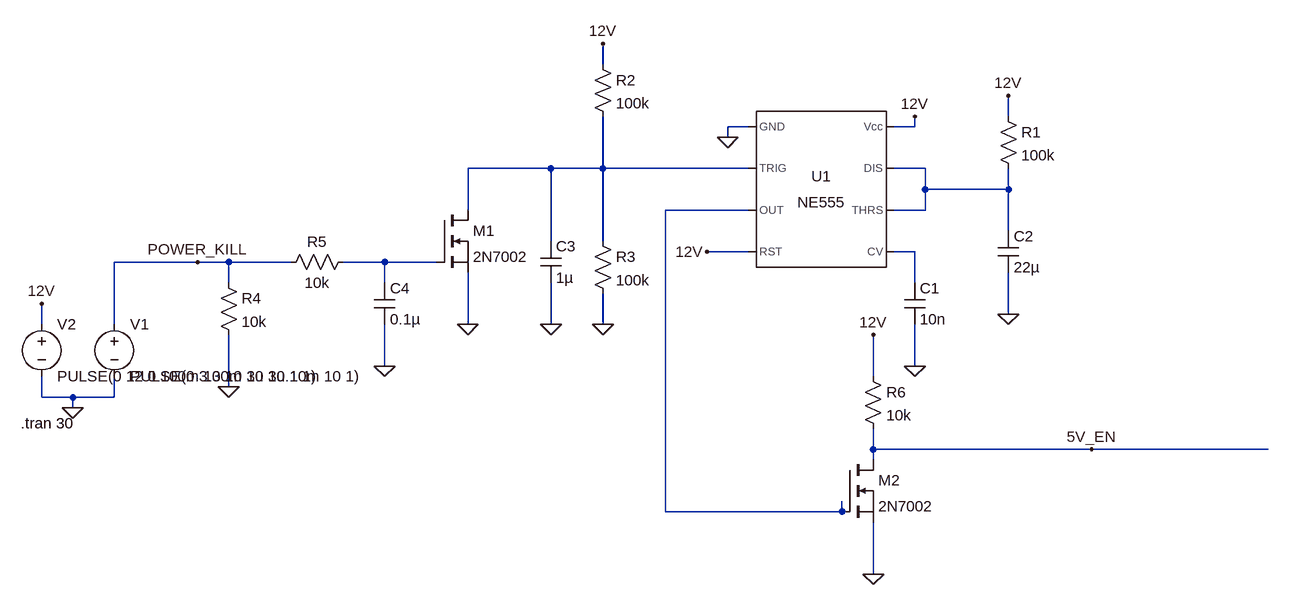
[diagram p0: schematic Power Killer 555.asc]
Power Killer 555.asc, the LTspice schematic file:
Version 4.1
SHEET 1 1028 680
WIRE 0 -160 0 -192
WIRE 624 -80 624 -112
WIRE 224 -64 192 -64
WIRE 480 -64 480 -80
WIRE 480 -64 448 -64
WIRE 192 -48 192 -64
WIRE -80 0 -208 0
WIRE 0 0 0 -80
WIRE 0 0 -80 0
WIRE 224 0 0 0
WIRE 496 0 448 0
WIRE 496 32 496 0
WIRE 624 32 624 0
WIRE 624 32 496 32
WIRE -208 64 -208 0
WIRE 224 64 96 64
WIRE 496 64 496 32
WIRE 496 64 448 64
WIRE 624 96 624 32
WIRE -80 112 -80 0
WIRE 0 112 0 0
WIRE 224 128 160 128
WIRE 480 128 448 128
WIRE -624 144 -752 144
WIRE -576 144 -624 144
WIRE -480 144 -576 144
WIRE -336 144 -400 144
WIRE -256 144 -336 144
WIRE -576 176 -576 144
WIRE -336 176 -336 144
WIRE 480 176 480 128
WIRE 624 224 624 160
WIRE -864 240 -864 208
WIRE -752 240 -752 144
WIRE -208 240 -208 160
WIRE -80 240 -80 176
WIRE 0 240 0 192
WIRE -336 304 -336 240
WIRE 480 304 480 240
WIRE 416 320 416 256
WIRE -576 336 -576 256
WIRE -864 352 -864 320
WIRE -816 352 -864 352
WIRE -752 352 -752 320
WIRE -752 352 -816 352
WIRE -816 368 -816 352
WIRE 416 432 416 400
WIRE 752 432 416 432
WIRE 1024 432 752 432
WIRE 416 448 416 432
WIRE 96 528 96 64
WIRE 368 528 368 512
WIRE 368 528 96 528
WIRE 416 624 416 544
FLAG -816 368 0
FLAG 192 -48 0
FLAG -864 208 12V
FLAG 480 -80 12V
FLAG 480 304 0
FLAG 624 -112 12V
FLAG 624 224 0
FLAG 160 128 12V
FLAG 0 -192 12V
FLAG -80 240 0
FLAG 0 240 0
FLAG -208 240 0
FLAG -336 304 0
FLAG -576 336 0
FLAG 416 624 0
FLAG 416 256 12V
FLAG 752 432 5V_EN
FLAG -624 144 POWER_KILL
SYMBOL voltage -752 224 R0
WINDOW 123 0 0 Left 0
WINDOW 39 0 0 Left 0
SYMATTR InstName V1
SYMATTR Value PULSE(0 3.3 10 1u 1u 10m 10 1)
SYMBOL voltage -864 224 R0
WINDOW 123 0 0 Left 0
WINDOW 39 0 0 Left 0
SYMATTR InstName V2
SYMATTR Value PULSE(0 12 0 100m 100m 30 30.1 1)
SYMBOL Misc\\NE555 336 32 R0
SYMATTR InstName U1
SYMBOL cap 464 176 R0
SYMATTR InstName C1
SYMATTR Value 10n
SYMBOL res 608 -96 R0
SYMATTR InstName R1
SYMATTR Value 100k
SYMBOL cap 608 96 R0
SYMATTR InstName C2
SYMATTR Value 22µ
SYMBOL res -16 -176 R0
SYMATTR InstName R2
SYMATTR Value 100k
SYMBOL res -16 96 R0
SYMATTR InstName R3
SYMATTR Value 100k
SYMBOL cap -96 112 R0
SYMATTR InstName C3
SYMATTR Value 1µ
SYMBOL nmos -256 64 R0
SYMATTR InstName M1
SYMATTR Value 2N7002
SYMBOL res -592 160 R0
SYMATTR InstName R4
SYMATTR Value 10k
SYMBOL res -384 128 R90
WINDOW 0 0 56 VBottom 2
WINDOW 3 32 56 VTop 2
SYMATTR InstName R5
SYMATTR Value 10k
SYMBOL cap -352 176 R0
SYMATTR InstName C4
SYMATTR Value 0.1µ
SYMBOL nmos 368 448 R0
SYMATTR InstName M2
SYMATTR Value 2N7002
SYMBOL res 400 304 R0
SYMATTR InstName R6
SYMATTR Value 10k
TEXT -896 392 Left 2 !.tran 30

The netlist it stands for:
* Power Killer 555.asc
V1 POWER_KILL 0 PULSE(0 3.3 10 1u 1u 10m 10 1)
V2 12V 0 PULSE(0 12 0 100m 100m 30 30.1 1)
X§U1 0 N001 N003 12V N004 N002 N002 12V NE555  ; pins GND TRIG OUT RST CV THRS DIS Vcc
C1 N004 0 10n
R1 12V N002 100k
C2 N002 0 22µ
R2 12V N001 100k
R3 N001 0 100k
C3 N001 0 1µ
M1 N001 N005 0 0 2N7002
R4 POWER_KILL 0 10k
R5 N005 POWER_KILL 10k
C4 N005 0 0.1µ
M2 5V_EN N003 0 0 2N7002
R6 12V 5V_EN 10k
.model NMOS NMOS
.model PMOS PMOS
.lib standard.mos
.tran 30
.lib NE555.sub
.backanno
.end